# Altium project FPGA_Peripheral_Board.PrjPcb (part 1 of 3)
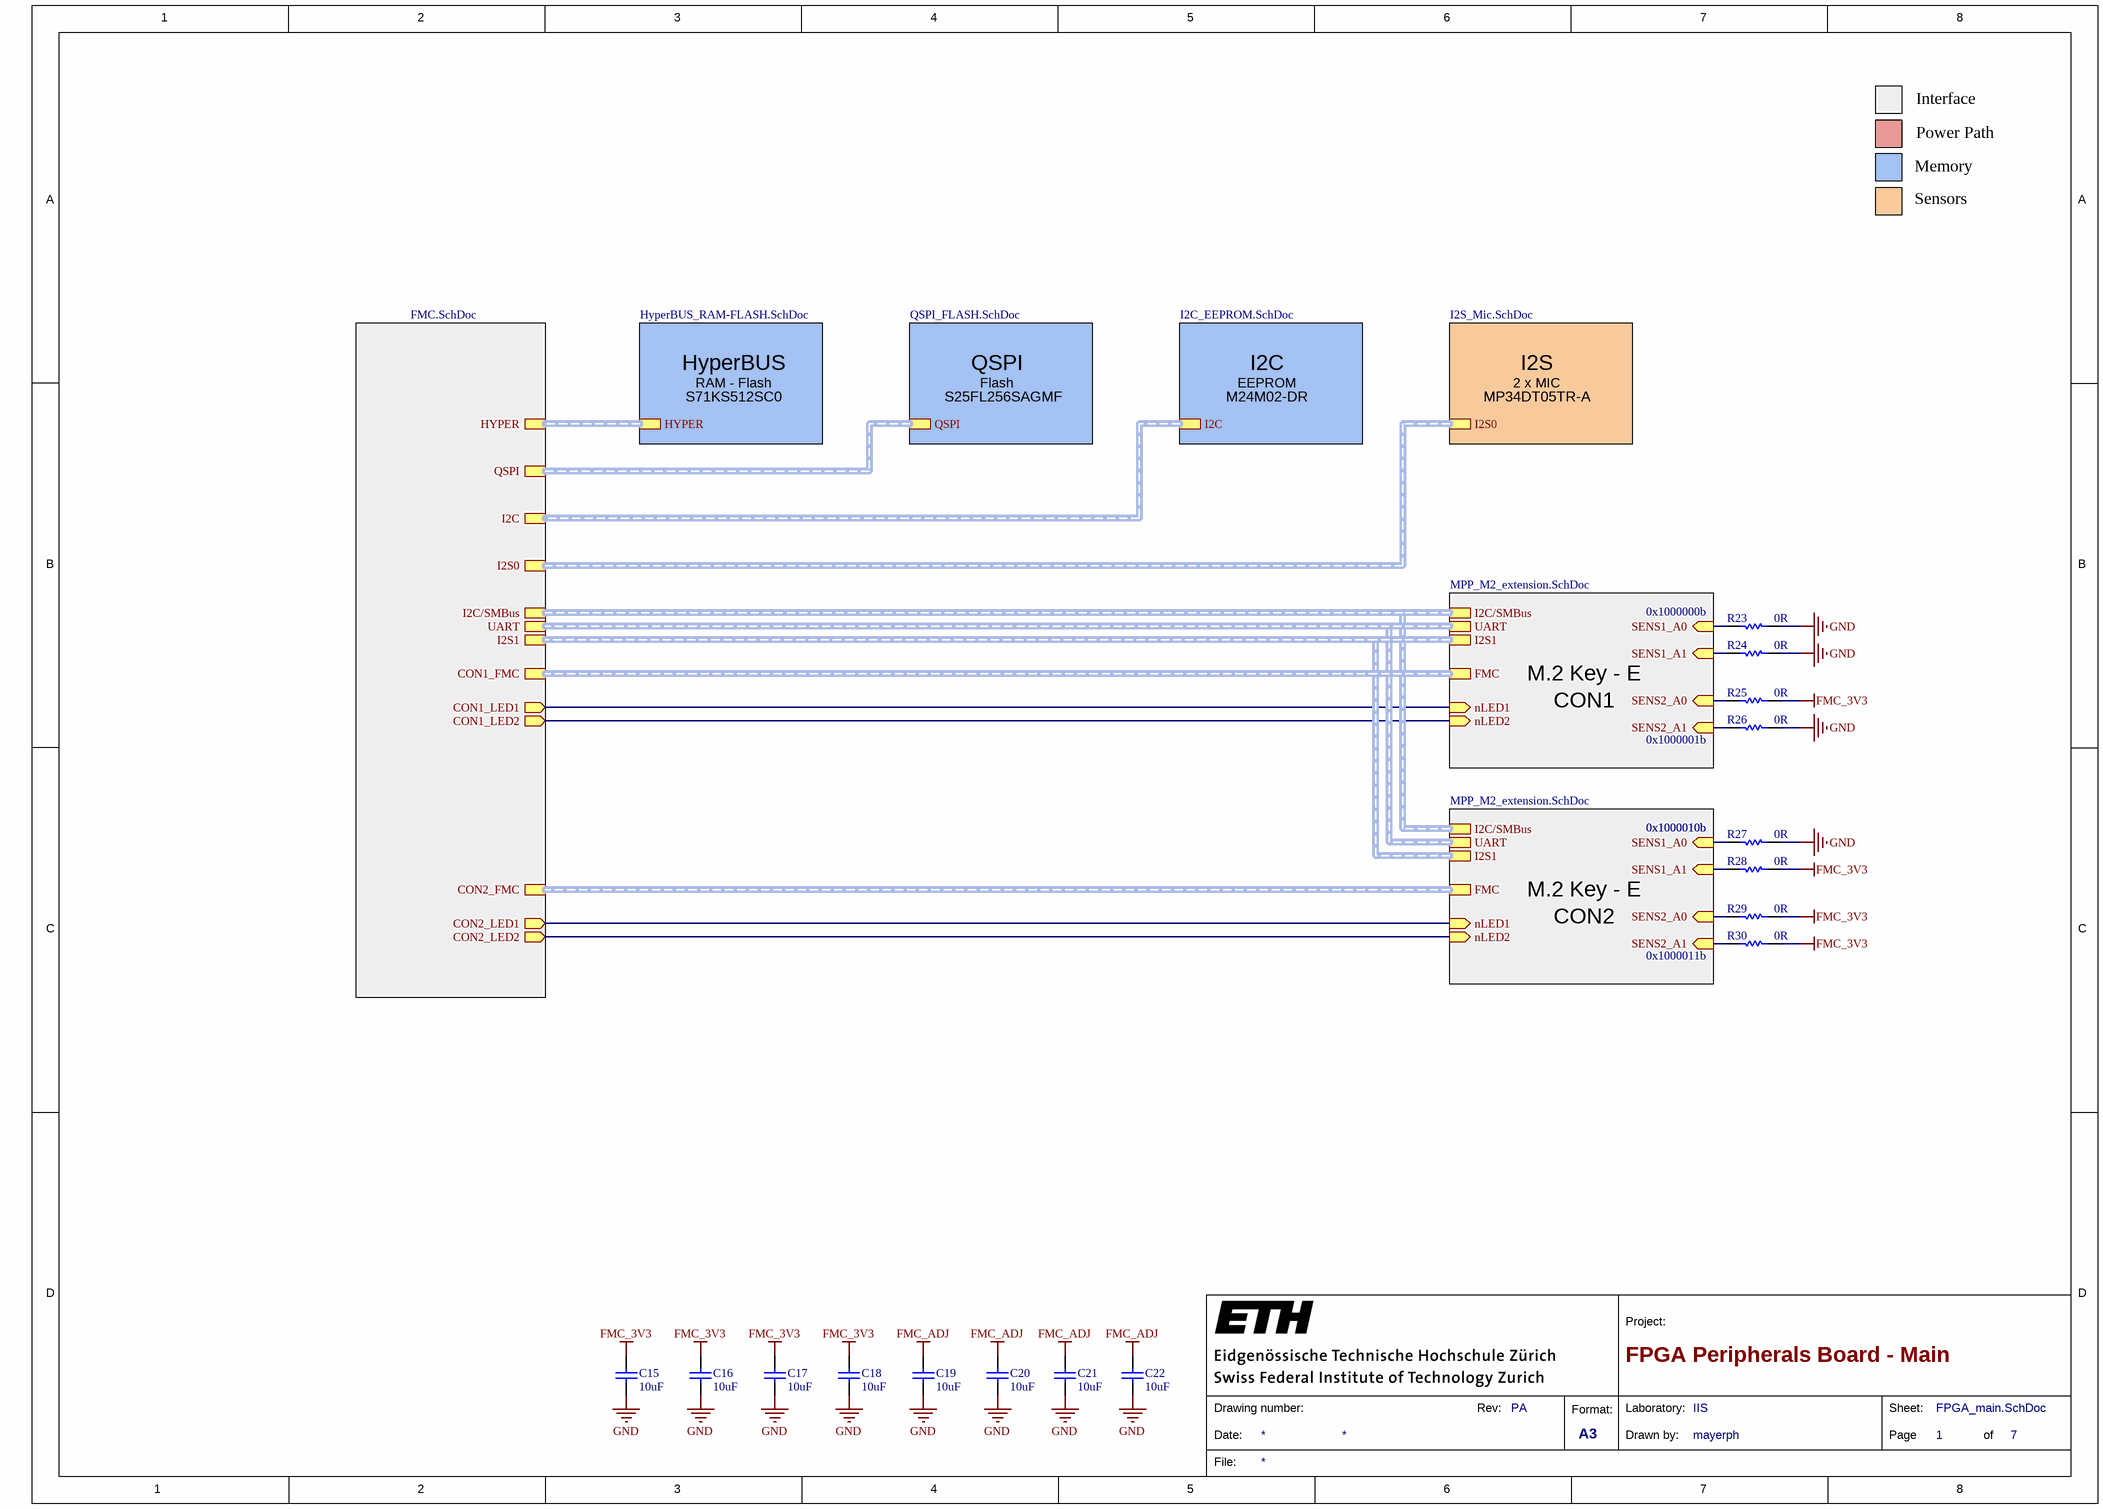
[diagram p0: FPGA_main.SchDoc]
author: Philipp Mayer; institute: Integrated Systems Laboratory; organization: ETH Zurich; productname: FPGA Peripherals Board; version: A
7 sheets, 111 parts. Net scope: hierarchical (ports join the sheet entries above them; power ports are global).
Board file: FPGA_Peripheral_Board.PcbDoc
Sheets:
  FPGA_main.SchDoc
    HYPER = HyperBUS_RAM-FLASH.SchDoc
    I2C = I2C_EEPROM.SchDoc
    QSPI = QSPI_FLASH.SchDoc
    I2S = I2S_Mic.SchDoc
    FMC = FMC.SchDoc
    CON1 = MPP_M2_extension.SchDoc
    CON2 = MPP_M2_extension.SchDoc

## Sheet FPGA_main.SchDoc: FPGA Peripherals Board - Main
size A3; Author: mayerph; DrawnBy: mayerph; Organization: IIS; Revision: PA; SheetNumber: 1; SheetTotal: 7

### Parts
C15  10uF  [CAPC1608X90X35LL15T15]
C16  10uF  [CAPC1608X90X35LL15T15]
C17  10uF  [CAPC1608X90X35LL15T15]
C18  10uF  [CAPC1608X90X35LL15T15]
C19  10uF  [CAPC1608X90X35LL15T15]
C20  10uF  [CAPC1608X90X35LL15T15]
C21  10uF  [CAPC1608X90X35LL15T15]
C22  10uF  [CAPC1608X90X35LL15T15]
R23  0R  [RESC1005X40X25LL05T10]
R24  0R  [RESC1005X40X25LL05T10]
R25  0R  [RESC1005X40X25LL05T10]
R26  0R  [RESC1005X40X25LL05T10]
R27  0R  [RESC1005X40X25LL05T10]
R28  0R  [RESC1005X40X25LL05T10]
R29  0R  [RESC1005X40X25LL05T10]
R30  0R  [RESC1005X40X25LL05T10]

### Sub-sheets
CON1 = MPP_M2_extension.SchDoc: FMC (harness FMC), I2S1 (harness I2S), nLED1 (in), I2C/SMBus (harness I2C/SMBus), UART (harness UART), nLED2 (in), SENS2_A0 (in), SENS1_A1 (in), SENS2_A1 (in), SENS1_A0 (in)
CON2 = MPP_M2_extension.SchDoc: FMC (harness FMC), I2S1 (harness I2S), nLED1 (in), I2C/SMBus (harness I2C/SMBus), UART (harness UART), nLED2 (in), SENS2_A0 (in), SENS1_A1 (in), SENS2_A1 (in), SENS1_A0 (in)
FMC = FMC.SchDoc: HYPER, QSPI, I2C, I2S0, I2C/SMBus, UART, I2S1, CON1_FMC, CON2_FMC, CON1_LED1 (out), CON1_LED2 (out), CON2_LED1 (out), CON2_LED2 (out)
HYPER = HyperBUS_RAM-FLASH.SchDoc: HYPER (harness HYPER)
I2C = I2C_EEPROM.SchDoc: I2C (harness I2C0)
I2S = I2S_Mic.SchDoc: I2S0 (harness I2S0)
QSPI = QSPI_FLASH.SchDoc: QSPI (harness QSPI0)

### Nets
FMC_3V3: C15.2 C16.2 C17.2 C18.2 R25.1 R28.1 R29.1 R30.1
FMC_ADJ: C19.2 C20.2 C21.2 C22.2
GND: C15.1 C16.1 C17.1 C18.1 C19.1 C20.1 C21.1 C22.1 R23.1 R24.1 R26.1 R27.1
nLED1: sheet FMC/CON1_LED1, sheet CON1/nLED1
nLED1: sheet FMC/CON2_LED1, sheet CON2/nLED1  [a separate net that carries the same name]
nLED2: sheet FMC/CON1_LED2, sheet CON1/nLED2
nLED2: sheet FMC/CON2_LED2, sheet CON2/nLED2  [a separate net that carries the same name]
NetR19_CON1_2: R23.2 ; sheet CON1/SENS1_A0
NetR19_CON2_2: R27.2 ; sheet CON2/SENS1_A0
NetR20_CON1_2: R24.2 ; sheet CON1/SENS1_A1
NetR20_CON2_2: R28.2 ; sheet CON2/SENS1_A1
NetR21_CON1_2: R25.2 ; sheet CON1/SENS2_A0
NetR21_CON2_2: R29.2 ; sheet CON2/SENS2_A0
NetR22_CON1_2: R26.2 ; sheet CON1/SENS2_A1
NetR22_CON2_2: R30.2 ; sheet CON2/SENS2_A1

### Buses and harness runs
harness sheet CON1/FMC = sheet FMC/CON1_FMC
harness sheet CON1/I2C/SMBus = sheet CON2/I2C/SMBus = sheet FMC/I2C/SMBus
harness sheet CON1/I2S1 = sheet CON2/I2S1 = sheet FMC/I2S1
harness sheet CON1/UART = sheet CON2/UART = sheet FMC/UART
harness sheet CON2/FMC = sheet FMC/CON2_FMC
harness sheet FMC/HYPER = sheet HYPER/HYPER
harness sheet FMC/I2C = sheet I2C/I2C
harness sheet FMC/I2S0 = sheet I2S/I2S0
harness sheet FMC/QSPI = sheet QSPI/QSPI

### Notes on the sheet
- Interface
- Memory
- Power Path
- Sensors
- HyperBUS
- RAM - Flash
- QSPI
- Flash
- I2C
- EEPROM
- I2S
- 2 x MIC
- S71KS512SC0
- S25FL256SAGMF
- M24M02-DR
- MP34DT05TR-A
- 0x1000000b
- M.2 Key - E
- CON1
- 0x1000001b
- 0x1000010b
- CON2
- 0x1000011b
- 1
- 2
- 3
- 4
- 5
- 6
- 7
- 8
- A
- B
- C
- D
- Project:
- Date:
- Drawing number:
- Rev:
- Format:
- A3
- Drawn by:
- Laboratory:
- Page
- Sheet:
- of
- File:

### Library data of the parts
C15-C22 = CMP-2006-04476-1: Manufacturer: AVX Interconnect / Elco; Part Number: 06036D106MAT2A; Dielectric Material: Ceramic; Tolerance: 20%; Voltage Rating: 6.3V; Dielectric: X5R; Supplier 1: Digi-Key; Supplier Part Number 1: 478-5318-1-ND; Manufacturer Part Number: 06036D106MAT2A; RoHS: Yes; Category: Ceramic Capacitors; Stock 1: 1934840; Pricing 1: 1=0.24000, 10=0.16500, 50=0.09900, 100=0.08360, 500=0.05720, 1000=0.05060 (USD); Mount: Surface Mount,PCB; Case/Package: 0603; Number of Pins: 2; Case Code (Metric): 1608; Case Code (Imperial): 0603; Contact Plating: Tin,Matte; Min Operating Temperature: -55°C; Max Operating Temperature: 85°C; Value: 10uF; Packaging: Tape and Reel; Package Quantity: 1; Voltage Rating (DC): 6.3V; Termination: SMD/SMT; Series: -; Construction: Flat; Voltage: 6.3V; Length: 1.6mm; Width: 0.032inch; Height: 0.9mm; Thickness: 0.035inch; Depth: 0.81mm; Radiation Hardening: No; RoHS Compliant: Yes; Lead Free: Lead Free; REACH SVHC: No SVHC; ComponentLink1URL: https://datasheet.ciiva.com/153/cx5r-153301.pdf?src-supplier=Digi-Key; ComponentLink1Description: https://datasheet.ciiva.com/153/cx5r-153301.pdf?src-supplier=Digi-Key; ComponentLink2URL: https://datasheet.ciiva.com/1458/1796776-1458117.pdf?src-supplier=Element14; ComponentLink2Description: https://datasheet.ciiva.com/1458/1796776-1458117.pdf?src-supplier=Element14; ComponentLink3URL: https://datasheet.ciiva.com/153/cx5r-153302.pdf?src-supplier=Digi-Key; ComponentLink3Description: https://datasheet.ciiva.com/153/cx5r-153302.pdf?src-supplier=Digi-Key; ComponentLink4URL: https://datasheet.ciiva.com/153/cx5r-153303.pdf?src-supplier=Digi-Key; ComponentLink4Description: https://datasheet.ciiva.com/153/cx5r-153303.pdf?src-supplier=Digi-Key; ComponentLink5URL: https://datasheet.ciiva.com/5422/cx5r-33896-5422935.pdf?src-supplier=Mouser; ComponentLink5Description: https://datasheet.ciiva.com/5422/cx5r-33896-5422935.pdf?src-supplier=Mouser; ComponentLink6URL: https://datasheet.ciiva.com/16538/cx5r-16538025.pdf?src-supplier=Avnet+Asia; ComponentLink6Description: https://datasheet.ciiva.com/16538/cx5r-16538025.pdf?src-supplier=Avnet+Asia; ComponentLink7URL: https://datasheet.ciiva.com/2987/cx5r-2987866.pdf?src-supplier=Avnet; ComponentLink7Description: https://datasheet.ciiva.com/2987/cx5r-2987866.pdf?src-supplier=Avnet; ComponentLink8URL: https://datasheet.ciiva.com/14591/70001028-14591754.pdf?src-supplier=Allied+Electronics; ComponentLink8Description: https://datasheet.ciiva.com/14591/70001028-14591754.pdf?src-supplier=Allied+Electronics; ComponentLink9URL: https://datasheet.ciiva.com/2987/cx5r-2987867.pdf?src-supplier=Avnet; ComponentLink9Description: https://datasheet.ciiva.com/2987/cx5r-2987867.pdf?src-supplier=Avnet; ComponentLink10URL: https://datasheet.ciiva.com/16201/cx5r-16201627.pdf?src-supplier=Future+Electronics; ComponentLink10Description: https://datasheet.ciiva.com/16201/cx5r-16201627.pdf?src-supplier=Future+Electronics
R23-R30 = CMP-2002-07912-1: Manufacturer: Yageo; Part Number: RC0402JR-070RL; Value: 0 Ohm; Power Rating: 62.5mW; Tolerance: 5%; Voltage Rating: 50V; Temperature Coefficient: 200ppm/°C; Max Power Dissipation: 63mW; Supplier 1: Digi-Key; Supplier Part Number 1: 311-0.0JRCT-ND; Manufacturer Part Number: RC0402JR-070RL; RoHS: Yes; Category: Chip SMD Resistors; Stock 1: 44193294; Pricing 1: 1=0.10000, 10=0.01200, 25=0.00840, 50=0.00640, 100=0.00480, 250=0.00364, 500=0.00292, 1000=0.00215, 5000=0.00154 (USD); Case/Package: 0402; Contact Plating: Tin,Matte; Case Code (Metric): 1005; Case Code (Imperial): 0402; Min Operating Temperature: -55°C; Max Operating Temperature: 155°C; Resistor Type: Thick Film; Packaging: Tape and Reel; Termination: SMD/SMT; Package Quantity: 1; Number of Terminations: 2; Features: Moisture Resistant; Length: 1mm; Height: 0.016inch; Width: 0.02inch; Depth: 0.5mm; Radiation Hardening: No; Lead Free: Lead Free; REACH SVHC: Unknown; Military Standard: Not; ComponentLink1URL: https://datasheet.ciiva.com/2452/pyu-rc0402-51-rohs-l-6-2452608.pdf?src-supplier=Digi-Key; ComponentLink1Description: https://datasheet.ciiva.com/2452/pyu-rc0402-51-rohs-l-6-2452608.pdf?src-supplier=Digi-Key; ComponentLink2URL: https://datasheet.ciiva.com/11808/0900766b80c66297-11808195.pdf?src-supplier=RSComponents; ComponentLink2Description: https://datasheet.ciiva.com/11808/0900766b80c66297-11808195.pdf?src-supplier=RSComponents; ComponentLink3URL: https://datasheet.ciiva.com/2452/pyu-r-int-thick-7-2452609.pdf?src-supplier=Digi-Key; ComponentLink3Description: https://datasheet.ciiva.com/2452/pyu-r-int-thick-7-2452609.pdf?src-supplier=Digi-Key; ComponentLink4URL: https://datasheet.ciiva.com/2452/pyu-r-int-thick-7-2452610.pdf?src-supplier=Digi-Key; ComponentLink4Description: https://datasheet.ciiva.com/2452/pyu-r-int-thick-7-2452610.pdf?src-supplier=Digi-Key; ComponentLink5URL: https://datasheet.ciiva.com/8896/pyu-rc0402-51-rohs-l-6-8896201.pdf?src-supplier=Avnet; ComponentLink5Description: https://datasheet.ciiva.com/8896/pyu-rc0402-51-rohs-l-6-8896201.pdf?src-supplier=Avnet; ComponentLink6URL: https://datasheet.ciiva.com/28386/pyu-rc0402-51-rohs-l-6-28386633.pdf?src-supplier=Avnet+Europe; ComponentLink6Description: https://datasheet.ciiva.com/28386/pyu-rc0402-51-rohs-l-6-28386633.pdf?src-supplier=Avnet+Europe; ComponentLink7URL: https://datasheet.ciiva.com/22747/1018594-22747515.pdf?src-supplier=Element14; ComponentLink7Description: https://datasheet.ciiva.com/22747/1018594-22747515.pdf?src-supplier=Element14; ComponentLink8URL: https://datasheet.ciiva.com/15189/getdatasheetpartid-326379-15189533.pdf?src-supplier=Verical; ComponentLink8Description: https://datasheet.ciiva.com/15189/getdatasheetpartid-326379-15189533.pdf?src-supplier=Verical; ComponentLink9URL: https://datasheet.ciiva.com/7983/1018594-7983535.pdf?src-supplier=Element14; ComponentLink9Description: https://datasheet.ciiva.com/7983/1018594-7983535.pdf?src-supplier=Element14

## Sheet HyperBUS_RAM-FLASH.SchDoc: FPGA Peripherals Board - HyperRAM / FLASH
size A4; Author: mayerph; DrawnBy: mayerph; Organization: IIS; Revision: PA; SheetNumber: 4; SheetTotal: 7
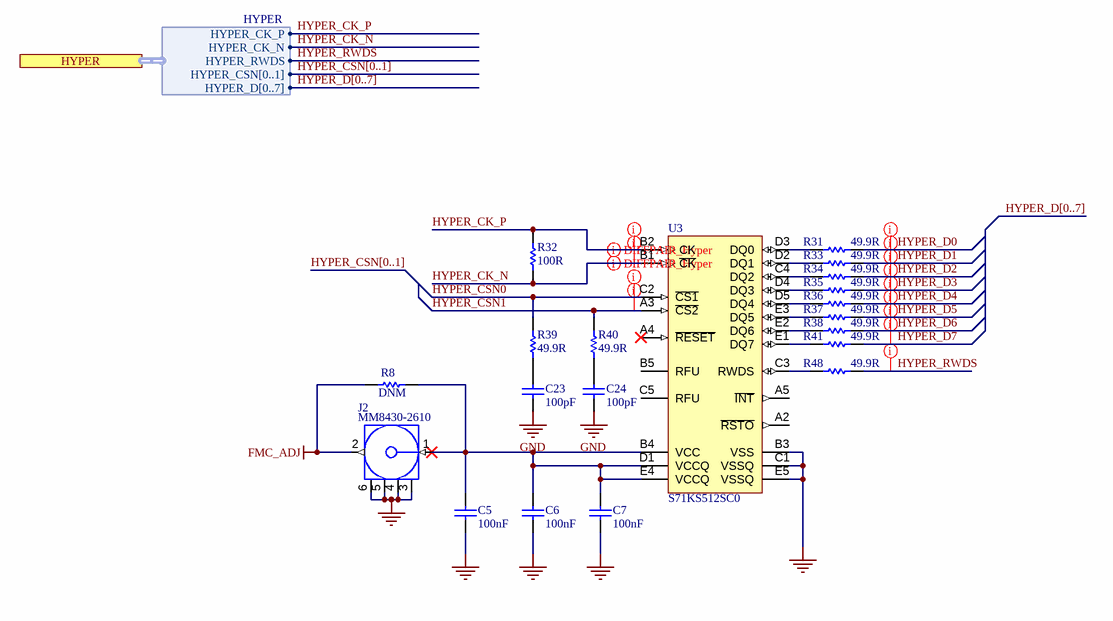
[diagram p1: HyperBUS_RAM-FLASH.SchDoc]

### Parts
C5  100nF  [CAPC1050X55X23LL05T13]
C6  100nF  [CAPC1050X55X23LL05T13]
C7  100nF  [CAPC1050X55X23LL05T13]
C23  100pF  [CAPC0603X33X15LL03T05]
C24  100pF  [CAPC0603X33X15LL03T05]
J2  MM8430-2610  [MM8430-2610]
R8  DNM  [RESC1005X40X25LL05T10]
R31  49.9R  [RESC0603X26X15LL03T05]
R32  100R  [RESC0603X28X15ML05T05]
R33  49.9R  [RESC0603X26X15LL03T05]
R34  49.9R  [RESC0603X26X15LL03T05]
R35  49.9R  [RESC0603X26X15LL03T05]
R36  49.9R  [RESC0603X26X15LL03T05]
R37  49.9R  [RESC0603X26X15LL03T05]
R38  49.9R  [RESC0603X26X15LL03T05]
R39  49.9R  [RESC0603X26X15LL03T05]
R40  49.9R  [RESC0603X26X15LL03T05]
R41  49.9R  [RESC0603X26X15LL03T05]
R48  49.9R  [RESC0603X26X15LL03T05]
U3  S71KS512SC0  [FBGA24_A-130]

### Ports
HYPER (harness HYPER)

### Harnesses
HYPER: HYPER_CK_N, HYPER_CK_P, HYPER_RWDS, HYPER_CSN[0..1], HYPER_D[0..7]

### Nets
FMC_ADJ: J2.2(Signal) R8.2
GND: C5.1 C6.1 C7.1 C23.2 C24.2 J2.3(GND) J2.4(GND) J2.5(GND) J2.6(GND) U3.B3(VSS) U3.C1(VSSQ) U3.E5(VSSQ)
HYPER_CK_N: R32.1 U3.B1(~{CK}) ; port HYPER.HYPER_CK_N
HYPER_CK_P: R32.2 U3.B2(CK) ; port HYPER.HYPER_CK_P
HYPER_CSN0: R39.1 U3.C2(~{CS1})
HYPER_CSN1: R40.1 U3.A3(~{CS2})
HYPER_D0: R31.1
HYPER_D1: R33.1
HYPER_D2: R34.1
HYPER_D3: R35.1
HYPER_D4: R36.1
HYPER_D5: R37.1
HYPER_D6: R38.1
HYPER_D7: R41.1
HYPER_RWDS: R48.1 ; port HYPER.HYPER_RWDS
NetC5_2: C5.2 C6.2 C7.2 J2.1(Signal) R8.1 U3.B4(VCC) U3.D1(VCCQ) U3.E4(VCCQ)
NetC23_1: C23.1 R39.2
NetC24_1: C24.1 R40.2
NetR31_2: R31.2 U3.D3(DQ0)
NetR33_2: R33.2 U3.D2(DQ1)
NetR34_2: R34.2 U3.C4(DQ2)
NetR35_2: R35.2 U3.D4(DQ3)
NetR36_2: R36.2 U3.D5(DQ4)
NetR37_2: R37.2 U3.E3(DQ5)
NetR38_2: R38.2 U3.E2(DQ6)
NetR41_2: R41.2 U3.E1(DQ7)
NetR48_2: R48.2 U3.C3(RWDS)

Not connected (* = marked no-connect by the designer): U3 A2(~{RSTO}) A4(~{RESET})* A5(~{INT}) B5(RFU) C5(RFU)

### Buses and harness runs
bus HYPER_CSN[0..1]
bus HYPER_D[0..7]

### Layout directives
differential pair; net class DIFFPAIR_Hyper: HYPER_CK_N, HYPER_CK_P
net class Hyper: HYPER_CK_N, HYPER_CK_P, HYPER_CSN0, HYPER_CSN1, HYPER_D0, HYPER_D1, HYPER_D2, HYPER_D3, HYPER_D4, HYPER_D5, HYPER_D6, HYPER_D7, HYPER_RWDS

### Notes on the sheet
- 1
- 2
- 3
- 4
- A
- B
- C
- Project:
- D
- Date:
- Drawing number:
- Rev:
- Format:
- A4 Q
- Drawn by:
- Laboratory:
- Page
- Sheet:
- of
- File:

### Library data of the parts
C5-C7 = CMP-2000-05439-1: Chip Capacitor, 100 nF, +/- 10%, 16 V, -55 to 125 degC, 0402 (1005 Metric), RoHS, Tape and Reel; Manufacturer: Samsung Electro-Mechanics; Manufacturer Part Number: CL05B104KO5NNNC; Dielectric: X7R; Rated Voltage: 16V; Material: Ceramic; Case Size/Dimension: 0402; Tolerance (%): ±10%; Value: 100nF; Manufacturer URL: http://www.samsungsem.com/global/index.jsp; Datasheet URL: https://datasheet.ciiva.com/29198/458718-da-01-en-vs-kondensator-0402-29198423.pdf; Datasheet Version: Nov-10; Supplier 1: Digi-Key; Supplier Part Number 1: 1276-1001-1-ND; RoHS: Yes; Category: Ceramic Capacitors; Stock 1: 18886859; Pricing 1: 1=0.10000, 10=0.02800, 50=0.01520, 100=0.01240, 500=0.00886, 1000=0.00696, 2500=0.00632, 5000=0.00582 (USD); Mount: Surface Mount; Case/Package: 0402; Case Code (Metric): 1005; Case Code (Imperial): 0402; Contact Plating: Tin; Min Operating Temperature: -55°C; Max Operating Temperature: 125°C; Tolerance: 10%; Packaging: Tape and Reel; Voltage Rating: 16V; Voltage Rating (DC): 16V; Package Quantity: 1; Voltage: 16V; Length: 1mm; Height: 0.5mm; Width: 0.02inch; Depth: 0.5mm; Thickness: 0.022inch; Radiation Hardening: No; Lead Free: Lead Free; ComponentLink1URL: https://datasheet.ciiva.com/26920/getdatasheetpartid-359683-26920169.pdf?src-supplier=Verical; ComponentLink1Description: https://datasheet.ciiva.com/26920/getdatasheetpartid-359683-26920169.pdf?src-supplier=Verical; ComponentLink2URL: https://datasheet.ciiva.com/29198/458718-da-01-en-vs-kondensator-0402-29198423.pdf?src-supplier=Conrad; ComponentLink2Description: https://datasheet.ciiva.com/29198/458718-da-01-en-vs-kondensator-0402-29198423.pdf?src-supplier=Conrad; ComponentLink3URL: https://datasheet.ciiva.com/16208/cl05b104kq5nnnc-16208343.pdf?src-supplier=Future+Electronics; ComponentLink3Description: https://datasheet.ciiva.com/16208/cl05b104kq5nnnc-16208343.pdf?src-supplier=Future+Electronics; ComponentLink4URL: https://datasheet.ciiva.com/26309/mlcc-catalogdownload2013-eng-26309003.pdf?src-supplier=Distrelec; ComponentLink4Description: https://datasheet.ciiva.com/26309/mlcc-catalogdownload2013-eng-26309003.pdf?src-supplier=Distrelec
C23 C24 = CMP-1033-00489-2: Part Number: 0201YC101KAT2A; Manufacturer: AVX Interconnect / Elco; Dielectric Material: Ceramic; Tolerance: 10%; Voltage Rating: 16V; Dielectric: X7R; Supplier 1: Digi-Key; Supplier Part Number 1: 478-1027-1-ND; Manufacturer Part Number: 0201YC101KAT2A; RoHS: Yes; Category: Ceramic Capacitors; Stock 1: 18398; Pricing 1: 1=0.36000, 10=0.24800, 50=0.17320, 100=0.14850, 500=0.11138, 1000=0.09405, 2500=0.08910, 5000=0.08415 (USD); Mount: Surface Mount; Case/Package: 0201; Number of Pins: 2; Case Code (Metric): 0603; Case Code (Imperial): 0201; Min Operating Temperature: -55°C; Max Operating Temperature: 125°C; Value: 100pF; Packaging: Tape and Reel; Package Quantity: 15000; Voltage Rating (DC): 16V; Termination: SMD/SMT; Series: -; Construction: Flat; Length: 0.6mm; Width: 0.012inch; Thickness: 0.013inch; Depth: 0.3mm; Radiation Hardening: No; RoHS Compliant: Yes; Lead Free: Lead Free; REACH SVHC: No SVHC; ComponentLink1URL: https://datasheet.ciiva.com/152/cx7r-152514.pdf?src-supplier=Digi-Key; ComponentLink1Description: https://datasheet.ciiva.com/152/cx7r-152514.pdf?src-supplier=Digi-Key; ComponentLink2URL: https://datasheet.ciiva.com/152/cx7r-152515.pdf?src-supplier=Digi-Key; ComponentLink2Description: https://datasheet.ciiva.com/152/cx7r-152515.pdf?src-supplier=Digi-Key; ComponentLink3URL: https://datasheet.ciiva.com/152/cx7r-152516.pdf?src-supplier=Digi-Key; ComponentLink3Description: https://datasheet.ciiva.com/152/cx7r-152516.pdf?src-supplier=Digi-Key; ComponentLink4URL: https://datasheet.ciiva.com/5427/cx7r-218113-5427893.pdf?src-supplier=Mouser; ComponentLink4Description: https://datasheet.ciiva.com/5427/cx7r-218113-5427893.pdf?src-supplier=Mouser; ComponentLink5URL: https://datasheet.ciiva.com/2990/cx7r-2990106.pdf?src-supplier=Avnet; ComponentLink5Description: https://datasheet.ciiva.com/2990/cx7r-2990106.pdf?src-supplier=Avnet; ComponentLink6URL: https://datasheet.ciiva.com/16328/cx7r-16328234.pdf?src-supplier=Future+Electronics; ComponentLink6Description: https://datasheet.ciiva.com/16328/cx7r-16328234.pdf?src-supplier=Future+Electronics; ComponentLink7URL: https://datasheet.ciiva.com/1123/683218-1123133.pdf?src-supplier=Element14; ComponentLink7Description: https://datasheet.ciiva.com/1123/683218-1123133.pdf?src-supplier=Element14; ComponentLink8URL: https://datasheet.ciiva.com/2987/cx7r-2987629.pdf?src-supplier=Avnet; ComponentLink8Description: https://datasheet.ciiva.com/2987/cx7r-2987629.pdf?src-supplier=Avnet
J2 = CMP-01324-2: SWD Connector Receptacle, Female Socket 50Ohm Surface Mount Solder; Manufacturer: Murata; Manufacturer Part Number: MM8430-2610RA1; Impedance: 50R; Max Frequency: 6GHz; Polarity: Standard; Description: CONN SWD RCPT STR 50 OHM SMD; Fastening Type: Pull; Max Operating Temperature: 85°C; Lead Free: Lead Free; Radiation Hardening: No; Package Quantity: 1; Series: 8430; Connector Type: Socket; Mount: Surface Mount; Contact Material: Copper Alloy; Housing Color: Silver; Case/Package: SMD/SMT; Orientation: Straight; Depth: 3mm; Packaging: Tape and Reel; Insulation Material: Plastic; Length: 3mm; Contact Plating: Gold; Min Operating Temperature: -40°C; Termination: Solder; Supplier 1: Digi-Key; Supplier Part Number 1: 490-4980-1-ND; RoHS: Yes; Category: RF / Coaxial Connectors; Stock 1: 398; Pricing 1: 1=0.49000, 10=0.45800, 25=0.41200, 50=0.36620, 100=0.35100, 250=0.32048, 500=0.30520 (USD); ComponentLink1URL: https://datasheet.ciiva.com/18119/getdatasheetpartid-163587-18119363.pdf?src-supplier=Verical; ComponentLink1Description: https://datasheet.ciiva.com/18119/getdatasheetpartid-163587-18119363.pdf?src-supplier=Verical; ComponentLink2URL: https://datasheet.ciiva.com/18119/getdatasheetpartid-153066-18119191.pdf?src-supplier=Verical; ComponentLink2Description: https://datasheet.ciiva.com/18119/getdatasheetpartid-153066-18119191.pdf?src-supplier=Verical; ComponentLink3URL: https://datasheet.ciiva.com/642/o33e-642736.pdf?src-supplier=Digi-Key; ComponentLink3Description: https://datasheet.ciiva.com/642/o33e-642736.pdf?src-supplier=Digi-Key; ComponentLink4URL: https://datasheet.ciiva.com/16465/l0391e-16465770.pdf?src-supplier=Future+Electronics; ComponentLink4Description: https://datasheet.ciiva.com/16465/l0391e-16465770.pdf?src-supplier=Future+Electronics; ComponentLink5URL: https://datasheet.ciiva.com/642/o33e-642735.pdf?src-supplier=Digi-Key; ComponentLink5Description: https://datasheet.ciiva.com/642/o33e-642735.pdf?src-supplier=Digi-Key
R8 = CMP-2002-07912-1: as R23 on sheet FPGA_main; Supplier 1: Digi-Key; Supplier Part Number 1: 311-0.0JRCT-ND; Manufacturer Part Number: RC0402JR-070RL; RoHS: Yes; Category: Chip SMD Resistors; Stock 1: 44193294; Pricing 1: 1=0.10000, 10=0.01200, 25=0.00840, 50=0.00640, 100=0.00480, 250=0.00364, 500=0.00292, 1000=0.00215, 5000=0.00154 (USD); Case/Package: 0402; Contact Plating: Tin,Matte; Case Code (Metric): 1005; Case Code (Imperial): 0402; Min Operating Temperature: -55°C; Max Operating Temperature: 155°C; Resistor Type: Thick Film; Packaging: Tape and Reel; Termination: SMD/SMT; Package Quantity: 1; Number of Terminations: 2; Features: Moisture Resistant; Length: 1mm; Height: 0.016inch; Width: 0.02inch; Depth: 0.5mm; Radiation Hardening: No; Lead Free: Lead Free; REACH SVHC: Unknown; Military Standard: Not; ComponentLink1URL: https://datasheet.ciiva.com/2452/pyu-rc0402-51-rohs-l-6-2452608.pdf?src-supplier=Digi-Key; ComponentLink1Description: https://datasheet.ciiva.com/2452/pyu-rc0402-51-rohs-l-6-2452608.pdf?src-supplier=Digi-Key; ComponentLink2URL: https://datasheet.ciiva.com/11808/0900766b80c66297-11808195.pdf?src-supplier=RSComponents; ComponentLink2Description: https://datasheet.ciiva.com/11808/0900766b80c66297-11808195.pdf?src-supplier=RSComponents; ComponentLink3URL: https://datasheet.ciiva.com/2452/pyu-r-int-thick-7-2452609.pdf?src-supplier=Digi-Key; ComponentLink3Description: https://datasheet.ciiva.com/2452/pyu-r-int-thick-7-2452609.pdf?src-supplier=Digi-Key; ComponentLink4URL: https://datasheet.ciiva.com/2452/pyu-r-int-thick-7-2452610.pdf?src-supplier=Digi-Key; ComponentLink4Description: https://datasheet.ciiva.com/2452/pyu-r-int-thick-7-2452610.pdf?src-supplier=Digi-Key; ComponentLink5URL: https://datasheet.ciiva.com/8896/pyu-rc0402-51-rohs-l-6-8896201.pdf?src-supplier=Avnet; ComponentLink5Description: https://datasheet.ciiva.com/8896/pyu-rc0402-51-rohs-l-6-8896201.pdf?src-supplier=Avnet; ComponentLink6URL: https://datasheet.ciiva.com/28386/pyu-rc0402-51-rohs-l-6-28386633.pdf?src-supplier=Avnet+Europe; ComponentLink6Description: https://datasheet.ciiva.com/28386/pyu-rc0402-51-rohs-l-6-28386633.pdf?src-supplier=Avnet+Europe; ComponentLink7URL: https://datasheet.ciiva.com/22747/1018594-22747515.pdf?src-supplier=Element14; ComponentLink7Description: https://datasheet.ciiva.com/22747/1018594-22747515.pdf?src-supplier=Element14; ComponentLink8URL: https://datasheet.ciiva.com/15189/getdatasheetpartid-326379-15189533.pdf?src-supplier=Verical; ComponentLink8Description: https://datasheet.ciiva.com/15189/getdatasheetpartid-326379-15189533.pdf?src-supplier=Verical; ComponentLink9URL: https://datasheet.ciiva.com/7983/1018594-7983535.pdf?src-supplier=Element14; ComponentLink9Description: https://datasheet.ciiva.com/7983/1018594-7983535.pdf?src-supplier=Element14
R31 R33-R41 R48 = CMP-2004-02983-1: Manufacturer: Panasonic; Part Number: ERJ-1GEF49R9C; Value: 49.9 Ohm; Tolerance: 1%; Temperature Coefficient: 200ppm/°C; Max Power Dissipation: 50mW; Voltage Rating: 25V; Voltage Rating (DC): 15V; Supplier 1: Digi-Key; Supplier Part Number 1: P49.9ABCT-ND; Manufacturer Part Number: ERJ-1GEF49R9C; RoHS: Yes; Category: Chip SMD Resistors; Stock 1: 2; Pricing 1: 1=0.10000, 10=0.03800, 100=0.01530, 1000=0.00689, 2500=0.00598, 5000=0.00494 (USD); Mount: Surface Mount; Case/Package: 0201; Case Code (Metric): 0603; Case Code (Imperial): 0201; Contact Plating: Tin; Min Operating Temperature: -55°C; Max Operating Temperature: 125°C; Packaging: Tape and Reel; Resistor Type: Thick Film; Number of Terminations: 2; Power Rating: 50mW; Package Quantity: 1; Series: ERJ; Termination: SMD/SMT; Construction: Rectangular; Resistance Tolerance: 1%; Technology: THICK FILM; Working Voltage: 25V; Length: 0.6mm; Width: 0.012inch; Height: 0.23mm; Depth: 0.3mm; Radiation Hardening: No; RoHS Compliant: Yes; Lead Free: Lead Free; Military Standard: Not; REACH SVHC: Unknown; ComponentLink1URL: https://datasheet.ciiva.com/16201/erj-1gef49r9c-16201490.pdf?src-supplier=Future+Electronics; ComponentLink1Description: https://datasheet.ciiva.com/16201/erj-1gef49r9c-16201490.pdf?src-supplier=Future+Electronics; ComponentLink2URL: https://datasheet.ciiva.com/2439/erj-g-r-e-rev08-2439298.pdf?src-supplier=Digi-Key; ComponentLink2Description: https://datasheet.ciiva.com/2439/erj-g-r-e-rev08-2439298.pdf?src-supplier=Digi-Key; ComponentLink3URL: https://datasheet.ciiva.com/2439/erj-g-r-e-rev08-2439299.pdf?src-supplier=Digi-Key; ComponentLink3Description: https://datasheet.ciiva.com/2439/erj-g-r-e-rev08-2439299.pdf?src-supplier=Digi-Key; ComponentLink4URL: https://datasheet.ciiva.com/2439/erj-g-r-e-rev08-2439300.pdf?src-supplier=Digi-Key; ComponentLink4Description: https://datasheet.ciiva.com/2439/erj-g-r-e-rev08-2439300.pdf?src-supplier=Digi-Key; ComponentLink5URL: https://datasheet.ciiva.com/16777/70260683-16777270.pdf?src-supplier=Allied+Electronics; ComponentLink5Description: https://datasheet.ciiva.com/16777/70260683-16777270.pdf?src-supplier=Allied+Electronics; ComponentLink6URL: https://datasheet.ciiva.com/28548/1694929-28548246.pdf?src-supplier=Element14; ComponentLink6Description: https://datasheet.ciiva.com/28548/1694929-28548246.pdf?src-supplier=Element14; ComponentLink7URL: https://datasheet.ciiva.com/30159/aoa0000ce2-30159798.pdf?src-supplier=Onlinecomponents.com; ComponentLink7Description: https://datasheet.ciiva.com/30159/aoa0000ce2-30159798.pdf?src-supplier=Onlinecomponents.com; ComponentLink8URL: https://datasheet.ciiva.com/7920/1678796-7920599.pdf?src-supplier=Element14; ComponentLink8Description: https://datasheet.ciiva.com/7920/1678796-7920599.pdf?src-supplier=Element14
R32 = CMP-2004-00005-1: Part Number: CRCW0201100RFKED; Manufacturer: Vishay; Value: 100 Ohm; Tolerance: 1%; Temperature Coefficient: 100ppm/°C; Voltage Rating: 30V; Power Rating: 50mW; Supplier 1: Digi-Key; Supplier Part Number 1: 541-100AABCT-ND; Manufacturer Part Number: CRCW0201100RFKED; RoHS: Yes; Category: Chip SMD Resistors; Stock 1: 306407; Pricing 1: 1=0.25000, 10=0.20900, 100=0.08170, 1000=0.03420, 2500=0.03135, 5000=0.02850 (USD); Mount: Surface Mount; Case/Package: 0201; Number of Pins: 2; Case Code (Imperial): 0201; Case Code (Metric): 0603; Contact Plating: Tin; Weight: 6E-06oz; Size Code: 0201; Min Operating Temperature: -55°C; Max Operating Temperature: 155°C; Packaging: Tape and Reel; Resistor Type: Thick Film; Max Power Dissipation: 50mW; Number of Terminations: 2; Series: CRCW; Package Quantity: 10000; Termination: SMD/SMT; Resistance Tolerance: 1%; Construction: Rectangular; Length: 0.6mm; Width: 0.3mm; Height: 0.23mm; Depth: 0.3mm; Radiation Hardening: No; RoHS Compliant: Yes; REACH SVHC: Unknown; Military Standard: Not; ComponentLink1URL: https://datasheet.ciiva.com/17172/crcw0201e3-17172232.pdf?src-supplier=Avnet+Europe; ComponentLink1Description: https://datasheet.ciiva.com/17172/crcw0201e3-17172232.pdf?src-supplier=Avnet+Europe; ComponentLink2URL: https://datasheet.ciiva.com/16207/dcrcwe3-16207386.pdf?src-supplier=Future+Electronics; ComponentLink2Description: https://datasheet.ciiva.com/16207/dcrcwe3-16207386.pdf?src-supplier=Future+Electronics
U3 = CMP-00514-1: IC 512MB FLASH 64MB DRAM 24FBGA; Manufacturer: Cypress Semiconductor Corp; Manufacturer Part Number: S71KS512SC0BHV000; Memory Format: FLASH, RAM; Memory Type: Non-Volatile; Memory Size: 512Mbit Flash, 64Mbit RAM; Speed: 100MHz; Interface: Parallel, Serial; Voltage - Supply: 1.8V; Series: HyperFlash™ + HyperRAM™ KS; Package / Case: 24-VBGA; Supplier Device Package: 24-FBGA(6x8); Supplier 1: Digi-Key; Supplier Part Number 1: 428-S71KS512SC0BHV000-ND; RoHS: Yes; Category: Memory; Pricing 1: 1=17.40000, 10=16.10400, 25=15.88480, 40=15.68525, 80=13.74600, 338=13.15666, 676=13.07114, 1014=12.18701 (USD); ComponentLink1URL: http://www.cypress.com/file/322936/download?src-supplier=Digi-Key; ComponentLink1Description: http://www.cypress.com/file/322936/download?src-supplier=Digi-Key

## Sheet I2C_EEPROM.SchDoc: FPGA Peripherals Board - EEPROM
size A4; Author: mayerph; DrawnBy: mayerph; Organization: IIS; Revision: PA; SheetNumber: 6; SheetTotal: 7
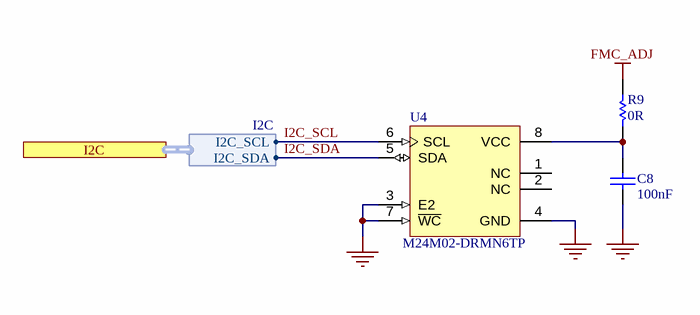
[diagram p2: I2C_EEPROM.SchDoc]

### Parts
C8  100nF  [CAPC1050X55X23LL05T13]
R9  0R  [RESC1005X40X25LL05T10]
U4  M24M02-DRMN6TP  [M08A_N]

### Ports
I2C (harness I2C)

### Harnesses
I2C: I2C_SDA, I2C_SCL

### Nets
FMC_ADJ: R9.2
GND: C8.1 U4.3(E2) U4.4(GND) U4.7(~{WC})
I2C_SCL: U4.6(SCL) ; port I2C.I2C_SCL
I2C_SDA: U4.5(SDA) ; port I2C.I2C_SDA
NetC8_2: C8.2 R9.1 U4.8(VCC)

Not connected (* = marked no-connect by the designer): U4 1(NC) 2(NC)

### Notes on the sheet
- 1
- 2
- 3
- 4
- A
- B
- C
- Project:
- D
- Date:
- Drawing number:
- Rev:
- Format:
- A4 Q
- Drawn by:
- Laboratory:
- Page
- Sheet:
- of
- File:

### Library data of the parts
C8 = CMP-2000-05439-1: as C5 on sheet HyperBUS_RAM-FLASH; Case Size/Dimension: 0402; Tolerance (%): ±10%; Value: 100nF; Manufacturer URL: http://www.samsungsem.com/global/index.jsp; Datasheet URL: https://datasheet.ciiva.com/29198/458718-da-01-en-vs-kondensator-0402-29198423.pdf; Datasheet Version: Nov-10; Supplier 1: Digi-Key; Supplier Part Number 1: 1276-1001-1-ND; RoHS: Yes; Category: Ceramic Capacitors; Stock 1: 18886859; Pricing 1: 1=0.10000, 10=0.02800, 50=0.01520, 100=0.01240, 500=0.00886, 1000=0.00696, 2500=0.00632, 5000=0.00582 (USD); Mount: Surface Mount; Case/Package: 0402; Case Code (Metric): 1005; Case Code (Imperial): 0402; Contact Plating: Tin; Min Operating Temperature: -55°C; Max Operating Temperature: 125°C; Tolerance: 10%; Packaging: Tape and Reel; Voltage Rating: 16V; Voltage Rating (DC): 16V; Package Quantity: 1; Voltage: 16V; Length: 1mm; Height: 0.5mm; Width: 0.02inch; Depth: 0.5mm; Thickness: 0.022inch; Radiation Hardening: No; Lead Free: Lead Free; ComponentLink1URL: https://datasheet.ciiva.com/26920/getdatasheetpartid-359683-26920169.pdf?src-supplier=Verical; ComponentLink1Description: https://datasheet.ciiva.com/26920/getdatasheetpartid-359683-26920169.pdf?src-supplier=Verical; ComponentLink2URL: https://datasheet.ciiva.com/29198/458718-da-01-en-vs-kondensator-0402-29198423.pdf?src-supplier=Conrad; ComponentLink2Description: https://datasheet.ciiva.com/29198/458718-da-01-en-vs-kondensator-0402-29198423.pdf?src-supplier=Conrad; ComponentLink3URL: https://datasheet.ciiva.com/16208/cl05b104kq5nnnc-16208343.pdf?src-supplier=Future+Electronics; ComponentLink3Description: https://datasheet.ciiva.com/16208/cl05b104kq5nnnc-16208343.pdf?src-supplier=Future+Electronics; ComponentLink4URL: https://datasheet.ciiva.com/26309/mlcc-catalogdownload2013-eng-26309003.pdf?src-supplier=Distrelec; ComponentLink4Description: https://datasheet.ciiva.com/26309/mlcc-catalogdownload2013-eng-26309003.pdf?src-supplier=Distrelec
R9 = CMP-2002-07912-1: as R23 on sheet FPGA_main; Supplier 1: Digi-Key; Supplier Part Number 1: 311-0.0JRCT-ND; Manufacturer Part Number: RC0402JR-070RL; RoHS: Yes; Category: Chip SMD Resistors; Stock 1: 44193294; Pricing 1: 1=0.10000, 10=0.01200, 25=0.00840, 50=0.00640, 100=0.00480, 250=0.00364, 500=0.00292, 1000=0.00215, 5000=0.00154 (USD); Case/Package: 0402; Contact Plating: Tin,Matte; Case Code (Metric): 1005; Case Code (Imperial): 0402; Min Operating Temperature: -55°C; Max Operating Temperature: 155°C; Resistor Type: Thick Film; Packaging: Tape and Reel; Termination: SMD/SMT; Package Quantity: 1; Number of Terminations: 2; Features: Moisture Resistant; Length: 1mm; Height: 0.016inch; Width: 0.02inch; Depth: 0.5mm; Radiation Hardening: No; Lead Free: Lead Free; REACH SVHC: Unknown; Military Standard: Not; ComponentLink1URL: https://datasheet.ciiva.com/2452/pyu-rc0402-51-rohs-l-6-2452608.pdf?src-supplier=Digi-Key; ComponentLink1Description: https://datasheet.ciiva.com/2452/pyu-rc0402-51-rohs-l-6-2452608.pdf?src-supplier=Digi-Key; ComponentLink2URL: https://datasheet.ciiva.com/11808/0900766b80c66297-11808195.pdf?src-supplier=RSComponents; ComponentLink2Description: https://datasheet.ciiva.com/11808/0900766b80c66297-11808195.pdf?src-supplier=RSComponents; ComponentLink3URL: https://datasheet.ciiva.com/2452/pyu-r-int-thick-7-2452609.pdf?src-supplier=Digi-Key; ComponentLink3Description: https://datasheet.ciiva.com/2452/pyu-r-int-thick-7-2452609.pdf?src-supplier=Digi-Key; ComponentLink4URL: https://datasheet.ciiva.com/2452/pyu-r-int-thick-7-2452610.pdf?src-supplier=Digi-Key; ComponentLink4Description: https://datasheet.ciiva.com/2452/pyu-r-int-thick-7-2452610.pdf?src-supplier=Digi-Key; ComponentLink5URL: https://datasheet.ciiva.com/8896/pyu-rc0402-51-rohs-l-6-8896201.pdf?src-supplier=Avnet; ComponentLink5Description: https://datasheet.ciiva.com/8896/pyu-rc0402-51-rohs-l-6-8896201.pdf?src-supplier=Avnet; ComponentLink6URL: https://datasheet.ciiva.com/28386/pyu-rc0402-51-rohs-l-6-28386633.pdf?src-supplier=Avnet+Europe; ComponentLink6Description: https://datasheet.ciiva.com/28386/pyu-rc0402-51-rohs-l-6-28386633.pdf?src-supplier=Avnet+Europe; ComponentLink7URL: https://datasheet.ciiva.com/22747/1018594-22747515.pdf?src-supplier=Element14; ComponentLink7Description: https://datasheet.ciiva.com/22747/1018594-22747515.pdf?src-supplier=Element14; ComponentLink8URL: https://datasheet.ciiva.com/15189/getdatasheetpartid-326379-15189533.pdf?src-supplier=Verical; ComponentLink8Description: https://datasheet.ciiva.com/15189/getdatasheetpartid-326379-15189533.pdf?src-supplier=Verical; ComponentLink9URL: https://datasheet.ciiva.com/7983/1018594-7983535.pdf?src-supplier=Element14; ComponentLink9Description: https://datasheet.ciiva.com/7983/1018594-7983535.pdf?src-supplier=Element14
U4 = CMP-00477-1: IC EEPROM 2MBIT 1MHZ 8SO; Manufacturer: STMicroelectronics; Access Time (Max): 900 ns; Data Retention: 40; Density: 2097152 Bit; Frequency: 0.4 MHz; Interface Type: Serial (I2C); Operating Supply Voltage (Max): 5.5 V; Operating Supply Voltage (Min): 1.8 V; Operating Supply Voltage (Typ): 2.5/3.3/5 V; Organization: 256Kx8; Programmable: Yes; Rad Hardened: No; Supply Current: 3 mA; Mounting: Surface Mount; Operating Temp Range: -40C to 85C; Operating Temperature (Max): 85C; Operating Temperature (Min): -40C; Operating Temperature Classification: Industrial; Package Type: SO N; Packaging: Tape and Reel; Pin Count: 8; Write Protection: Yes; Manufacturer Part Number: M24M02-DRMN6TP; Supplier: Digikey; Supplier Part Number: 497-11600-2-ND; ComponentLink1Description: cd00290537-117248-13031871.pdf; ComponentLink1URL: https://datasheet.ciiva.com/13031/cd00290537-117248-13031871.pdf; ComponentLink2Description: getdatasheetpartid-492578-15123683.pdf; ComponentLink2URL: https://datasheet.ciiva.com/15123/getdatasheetpartid-492578-15123683.pdf; ComponentLink3Description: cd00290537-1912489.pdf; ComponentLink3URL: https://datasheet.ciiva.com/1912/cd00290537-1912489.pdf; ComponentLink4Description: cd00290537-1912488.pdf; ComponentLink4URL: https://datasheet.ciiva.com/1912/cd00290537-1912488.pdf; ComponentLink5Description: cd00290537-1912487.pdf; ComponentLink5URL: https://datasheet.ciiva.com/1912/cd00290537-1912487.pdf; ComponentLink6Description: cd00290537-16448168.pdf; ComponentLink6URL: https://datasheet.ciiva.com/16448/cd00290537-16448168.pdf

## Sheet QSPI_FLASH.SchDoc: FPGA Peripherals Board - FLASH
size A4; Author: mayerph; DrawnBy: mayerph; Organization: IIS; Revision: PA; SheetNumber: 5; SheetTotal: 7
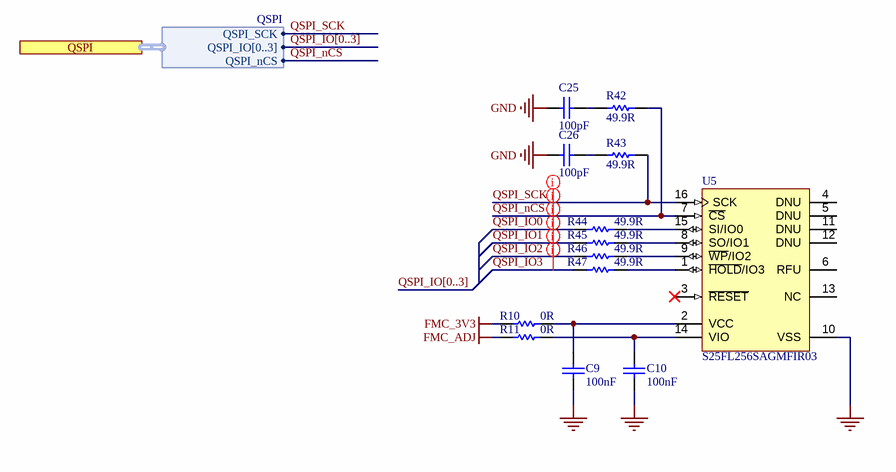
[diagram p3: QSPI_FLASH.SchDoc]

### Parts
C9  100nF  [CAPC1050X55X23LL05T13]
C10  100nF  [CAPC1050X55X23LL05T13]
C25  100pF  [CAPC0603X33X15LL03T05]
C26  100pF  [CAPC0603X33X15LL03T05]
R10  0R  [RESC1005X40X25LL05T10]
R11  0R  [RESC1005X40X25LL05T10]
R42  49.9R  [RESC0603X26X15LL03T05]
R43  49.9R  [RESC0603X26X15LL03T05]
R44  49.9R  [RESC0603X26X15LL03T05]
R45  49.9R  [RESC0603X26X15LL03T05]
R46  49.9R  [RESC0603X26X15LL03T05]
R47  49.9R  [RESC0603X26X15LL03T05]
U5  S25FL256SAGMFIR03  [SOIC127P1030X265-16N]

### Ports
QSPI (harness QSPI)

### Harnesses
QSPI: QSPI_SCK, QSPI_IO[0..3], QSPI_nCS

### Nets
FMC_3V3: R10.2
FMC_ADJ: R11.2
GND: C9.1 C10.1 C25.2 C26.2 U5.10(VSS)
QSPI_IO0: R44.2
QSPI_IO1: R45.2
QSPI_IO2: R46.2
QSPI_IO3: R47.2
QSPI_nCS: R42.1 U5.7(~{CS}) ; port QSPI.QSPI_nCS
QSPI_SCK: R43.1 U5.16(SCK) ; port QSPI.QSPI_SCK
NetC9_2: C9.2 R10.1 U5.2(VCC)
NetC10_2: C10.2 R11.1 U5.14(VIO)
NetC25_1: C25.1 R42.2
NetC26_1: C26.1 R43.2
NetR44_1: R44.1 U5.15(SI/IO0)
NetR45_1: R45.1 U5.8(SO/IO1)
NetR46_1: R46.1 U5.9(~{WP}/IO2)
NetR47_1: R47.1 U5.1(~{HOLD}/IO3)

Not connected (* = marked no-connect by the designer): U5 3(~{RESET})* 4(DNU) 5(DNU) 6(RFU) 11(DNU) 12(DNU) 13(NC)

### Buses and harness runs
bus QSPI_IO[0..3]

### Layout directives
net class QSPI0: QSPI_IO0, QSPI_IO1, QSPI_IO2, QSPI_IO3, QSPI_nCS, QSPI_SCK

### Notes on the sheet
- 1
- 2
- 3
- 4
- A
- B
- C
- Project:
- D
- Date:
- Drawing number:
- Rev:
- Format:
- A4 Q
- Drawn by:
- Laboratory:
- Page
- Sheet:
- of
- File:

### Library data of the parts
C9 C10 = CMP-2000-05439-1: as C5 on sheet HyperBUS_RAM-FLASH; Case Size/Dimension: 0402; Tolerance (%): ±10%; Value: 100nF; Manufacturer URL: http://www.samsungsem.com/global/index.jsp; Datasheet URL: https://datasheet.ciiva.com/29198/458718-da-01-en-vs-kondensator-0402-29198423.pdf; Datasheet Version: Nov-10; Supplier 1: Digi-Key; Supplier Part Number 1: 1276-1001-1-ND; RoHS: Yes; Category: Ceramic Capacitors; Stock 1: 18886859; Pricing 1: 1=0.10000, 10=0.02800, 50=0.01520, 100=0.01240, 500=0.00886, 1000=0.00696, 2500=0.00632, 5000=0.00582 (USD); Mount: Surface Mount; Case/Package: 0402; Case Code (Metric): 1005; Case Code (Imperial): 0402; Contact Plating: Tin; Min Operating Temperature: -55°C; Max Operating Temperature: 125°C; Tolerance: 10%; Packaging: Tape and Reel; Voltage Rating: 16V; Voltage Rating (DC): 16V; Package Quantity: 1; Voltage: 16V; Length: 1mm; Height: 0.5mm; Width: 0.02inch; Depth: 0.5mm; Thickness: 0.022inch; Radiation Hardening: No; Lead Free: Lead Free; ComponentLink1URL: https://datasheet.ciiva.com/26920/getdatasheetpartid-359683-26920169.pdf?src-supplier=Verical; ComponentLink1Description: https://datasheet.ciiva.com/26920/getdatasheetpartid-359683-26920169.pdf?src-supplier=Verical; ComponentLink2URL: https://datasheet.ciiva.com/29198/458718-da-01-en-vs-kondensator-0402-29198423.pdf?src-supplier=Conrad; ComponentLink2Description: https://datasheet.ciiva.com/29198/458718-da-01-en-vs-kondensator-0402-29198423.pdf?src-supplier=Conrad; ComponentLink3URL: https://datasheet.ciiva.com/16208/cl05b104kq5nnnc-16208343.pdf?src-supplier=Future+Electronics; ComponentLink3Description: https://datasheet.ciiva.com/16208/cl05b104kq5nnnc-16208343.pdf?src-supplier=Future+Electronics; ComponentLink4URL: https://datasheet.ciiva.com/26309/mlcc-catalogdownload2013-eng-26309003.pdf?src-supplier=Distrelec; ComponentLink4Description: https://datasheet.ciiva.com/26309/mlcc-catalogdownload2013-eng-26309003.pdf?src-supplier=Distrelec
C25 C26 = CMP-1033-00489-2: as C23 on sheet HyperBUS_RAM-FLASH; Supplier 1: Digi-Key; Supplier Part Number 1: 478-1027-1-ND; Manufacturer Part Number: 0201YC101KAT2A; RoHS: Yes; Category: Ceramic Capacitors; Stock 1: 18398; Pricing 1: 1=0.36000, 10=0.24800, 50=0.17320, 100=0.14850, 500=0.11138, 1000=0.09405, 2500=0.08910, 5000=0.08415 (USD); Mount: Surface Mount; Case/Package: 0201; Number of Pins: 2; Case Code (Metric): 0603; Case Code (Imperial): 0201; Min Operating Temperature: -55°C; Max Operating Temperature: 125°C; Value: 100pF; Packaging: Tape and Reel; Package Quantity: 15000; Voltage Rating (DC): 16V; Termination: SMD/SMT; Series: -; Construction: Flat; Length: 0.6mm; Width: 0.012inch; Thickness: 0.013inch; Depth: 0.3mm; Radiation Hardening: No; RoHS Compliant: Yes; Lead Free: Lead Free; REACH SVHC: No SVHC; ComponentLink1URL: https://datasheet.ciiva.com/152/cx7r-152514.pdf?src-supplier=Digi-Key; ComponentLink1Description: https://datasheet.ciiva.com/152/cx7r-152514.pdf?src-supplier=Digi-Key; ComponentLink2URL: https://datasheet.ciiva.com/152/cx7r-152515.pdf?src-supplier=Digi-Key; ComponentLink2Description: https://datasheet.ciiva.com/152/cx7r-152515.pdf?src-supplier=Digi-Key; ComponentLink3URL: https://datasheet.ciiva.com/152/cx7r-152516.pdf?src-supplier=Digi-Key; ComponentLink3Description: https://datasheet.ciiva.com/152/cx7r-152516.pdf?src-supplier=Digi-Key; ComponentLink4URL: https://datasheet.ciiva.com/5427/cx7r-218113-5427893.pdf?src-supplier=Mouser; ComponentLink4Description: https://datasheet.ciiva.com/5427/cx7r-218113-5427893.pdf?src-supplier=Mouser; ComponentLink5URL: https://datasheet.ciiva.com/2990/cx7r-2990106.pdf?src-supplier=Avnet; ComponentLink5Description: https://datasheet.ciiva.com/2990/cx7r-2990106.pdf?src-supplier=Avnet; ComponentLink6URL: https://datasheet.ciiva.com/16328/cx7r-16328234.pdf?src-supplier=Future+Electronics; ComponentLink6Description: https://datasheet.ciiva.com/16328/cx7r-16328234.pdf?src-supplier=Future+Electronics; ComponentLink7URL: https://datasheet.ciiva.com/1123/683218-1123133.pdf?src-supplier=Element14; ComponentLink7Description: https://datasheet.ciiva.com/1123/683218-1123133.pdf?src-supplier=Element14; ComponentLink8URL: https://datasheet.ciiva.com/2987/cx7r-2987629.pdf?src-supplier=Avnet; ComponentLink8Description: https://datasheet.ciiva.com/2987/cx7r-2987629.pdf?src-supplier=Avnet
R10 R11 = CMP-2002-07912-1: as R23 on sheet FPGA_main; Supplier 1: Digi-Key; Supplier Part Number 1: 311-0.0JRCT-ND; Manufacturer Part Number: RC0402JR-070RL; RoHS: Yes; Category: Chip SMD Resistors; Stock 1: 44193294; Pricing 1: 1=0.10000, 10=0.01200, 25=0.00840, 50=0.00640, 100=0.00480, 250=0.00364, 500=0.00292, 1000=0.00215, 5000=0.00154 (USD); Case/Package: 0402; Contact Plating: Tin,Matte; Case Code (Metric): 1005; Case Code (Imperial): 0402; Min Operating Temperature: -55°C; Max Operating Temperature: 155°C; Resistor Type: Thick Film; Packaging: Tape and Reel; Termination: SMD/SMT; Package Quantity: 1; Number of Terminations: 2; Features: Moisture Resistant; Length: 1mm; Height: 0.016inch; Width: 0.02inch; Depth: 0.5mm; Radiation Hardening: No; Lead Free: Lead Free; REACH SVHC: Unknown; Military Standard: Not; ComponentLink1URL: https://datasheet.ciiva.com/2452/pyu-rc0402-51-rohs-l-6-2452608.pdf?src-supplier=Digi-Key; ComponentLink1Description: https://datasheet.ciiva.com/2452/pyu-rc0402-51-rohs-l-6-2452608.pdf?src-supplier=Digi-Key; ComponentLink2URL: https://datasheet.ciiva.com/11808/0900766b80c66297-11808195.pdf?src-supplier=RSComponents; ComponentLink2Description: https://datasheet.ciiva.com/11808/0900766b80c66297-11808195.pdf?src-supplier=RSComponents; ComponentLink3URL: https://datasheet.ciiva.com/2452/pyu-r-int-thick-7-2452609.pdf?src-supplier=Digi-Key; ComponentLink3Description: https://datasheet.ciiva.com/2452/pyu-r-int-thick-7-2452609.pdf?src-supplier=Digi-Key; ComponentLink4URL: https://datasheet.ciiva.com/2452/pyu-r-int-thick-7-2452610.pdf?src-supplier=Digi-Key; ComponentLink4Description: https://datasheet.ciiva.com/2452/pyu-r-int-thick-7-2452610.pdf?src-supplier=Digi-Key; ComponentLink5URL: https://datasheet.ciiva.com/8896/pyu-rc0402-51-rohs-l-6-8896201.pdf?src-supplier=Avnet; ComponentLink5Description: https://datasheet.ciiva.com/8896/pyu-rc0402-51-rohs-l-6-8896201.pdf?src-supplier=Avnet; ComponentLink6URL: https://datasheet.ciiva.com/28386/pyu-rc0402-51-rohs-l-6-28386633.pdf?src-supplier=Avnet+Europe; ComponentLink6Description: https://datasheet.ciiva.com/28386/pyu-rc0402-51-rohs-l-6-28386633.pdf?src-supplier=Avnet+Europe; ComponentLink7URL: https://datasheet.ciiva.com/22747/1018594-22747515.pdf?src-supplier=Element14; ComponentLink7Description: https://datasheet.ciiva.com/22747/1018594-22747515.pdf?src-supplier=Element14; ComponentLink8URL: https://datasheet.ciiva.com/15189/getdatasheetpartid-326379-15189533.pdf?src-supplier=Verical; ComponentLink8Description: https://datasheet.ciiva.com/15189/getdatasheetpartid-326379-15189533.pdf?src-supplier=Verical; ComponentLink9URL: https://datasheet.ciiva.com/7983/1018594-7983535.pdf?src-supplier=Element14; ComponentLink9Description: https://datasheet.ciiva.com/7983/1018594-7983535.pdf?src-supplier=Element14
R42-R47 = CMP-2004-02983-1: as R31 on sheet HyperBUS_RAM-FLASH; Supplier 1: Digi-Key; Supplier Part Number 1: P49.9ABCT-ND; Manufacturer Part Number: ERJ-1GEF49R9C; RoHS: Yes; Category: Chip SMD Resistors; Stock 1: 2; Pricing 1: 1=0.10000, 10=0.03800, 100=0.01530, 1000=0.00689, 2500=0.00598, 5000=0.00494 (USD); Mount: Surface Mount; Case/Package: 0201; Case Code (Metric): 0603; Case Code (Imperial): 0201; Contact Plating: Tin; Min Operating Temperature: -55°C; Max Operating Temperature: 125°C; Packaging: Tape and Reel; Resistor Type: Thick Film; Number of Terminations: 2; Power Rating: 50mW; Package Quantity: 1; Series: ERJ; Termination: SMD/SMT; Construction: Rectangular; Resistance Tolerance: 1%; Technology: THICK FILM; Working Voltage: 25V; Length: 0.6mm; Width: 0.012inch; Height: 0.23mm; Depth: 0.3mm; Radiation Hardening: No; RoHS Compliant: Yes; Lead Free: Lead Free; Military Standard: Not; REACH SVHC: Unknown; ComponentLink1URL: https://datasheet.ciiva.com/16201/erj-1gef49r9c-16201490.pdf?src-supplier=Future+Electronics; ComponentLink1Description: https://datasheet.ciiva.com/16201/erj-1gef49r9c-16201490.pdf?src-supplier=Future+Electronics; ComponentLink2URL: https://datasheet.ciiva.com/2439/erj-g-r-e-rev08-2439298.pdf?src-supplier=Digi-Key; ComponentLink2Description: https://datasheet.ciiva.com/2439/erj-g-r-e-rev08-2439298.pdf?src-supplier=Digi-Key; ComponentLink3URL: https://datasheet.ciiva.com/2439/erj-g-r-e-rev08-2439299.pdf?src-supplier=Digi-Key; ComponentLink3Description: https://datasheet.ciiva.com/2439/erj-g-r-e-rev08-2439299.pdf?src-supplier=Digi-Key; ComponentLink4URL: https://datasheet.ciiva.com/2439/erj-g-r-e-rev08-2439300.pdf?src-supplier=Digi-Key; ComponentLink4Description: https://datasheet.ciiva.com/2439/erj-g-r-e-rev08-2439300.pdf?src-supplier=Digi-Key; ComponentLink5URL: https://datasheet.ciiva.com/16777/70260683-16777270.pdf?src-supplier=Allied+Electronics; ComponentLink5Description: https://datasheet.ciiva.com/16777/70260683-16777270.pdf?src-supplier=Allied+Electronics; ComponentLink6URL: https://datasheet.ciiva.com/28548/1694929-28548246.pdf?src-supplier=Element14; ComponentLink6Description: https://datasheet.ciiva.com/28548/1694929-28548246.pdf?src-supplier=Element14; ComponentLink7URL: https://datasheet.ciiva.com/30159/aoa0000ce2-30159798.pdf?src-supplier=Onlinecomponents.com; ComponentLink7Description: https://datasheet.ciiva.com/30159/aoa0000ce2-30159798.pdf?src-supplier=Onlinecomponents.com; ComponentLink8URL: https://datasheet.ciiva.com/7920/1678796-7920599.pdf?src-supplier=Element14; ComponentLink8Description: https://datasheet.ciiva.com/7920/1678796-7920599.pdf?src-supplier=Element14
U5 = CMP-00165-1: NOR Flash Serial-SPI 3V 256M-bit 256M x 1bit 8ns 16-Pin SOIC; Manufacturer: Cypress Semiconductor Corp; Memory Type: FLASH - NOR; Memory Size: 256M (32M x 8); Speed: 133MHz; Interface: SPI Serial; Voltage - Supply: 2.7 V ~ 3.6 V; Packaging: *; Format - Memory: FLASH; Operating Temperature: -40°C ~ 85°C (TA); Supplier Device Package: 16-SO; Manufacturer Part Number: S25FL256SAGMFIR03; Supplier: Digi-Key; Supplier Part Number: S25FL256SAGMFIR03-ND; ComponentLink1Description: download; ComponentLink1URL: http://www.cypress.com/file/177966/download